# Altium schematic sheet Sheet1.SchDoc: *Omarichet Sat EPS
size Tabloid; CompanyName: *Omarichet_Space; DrawnBy: *Meshack_Kinyua; Engineer: *Meshack_Kinyua; Organization: *Omarichet Space; SheetNumber: 1; SheetTotal: 3
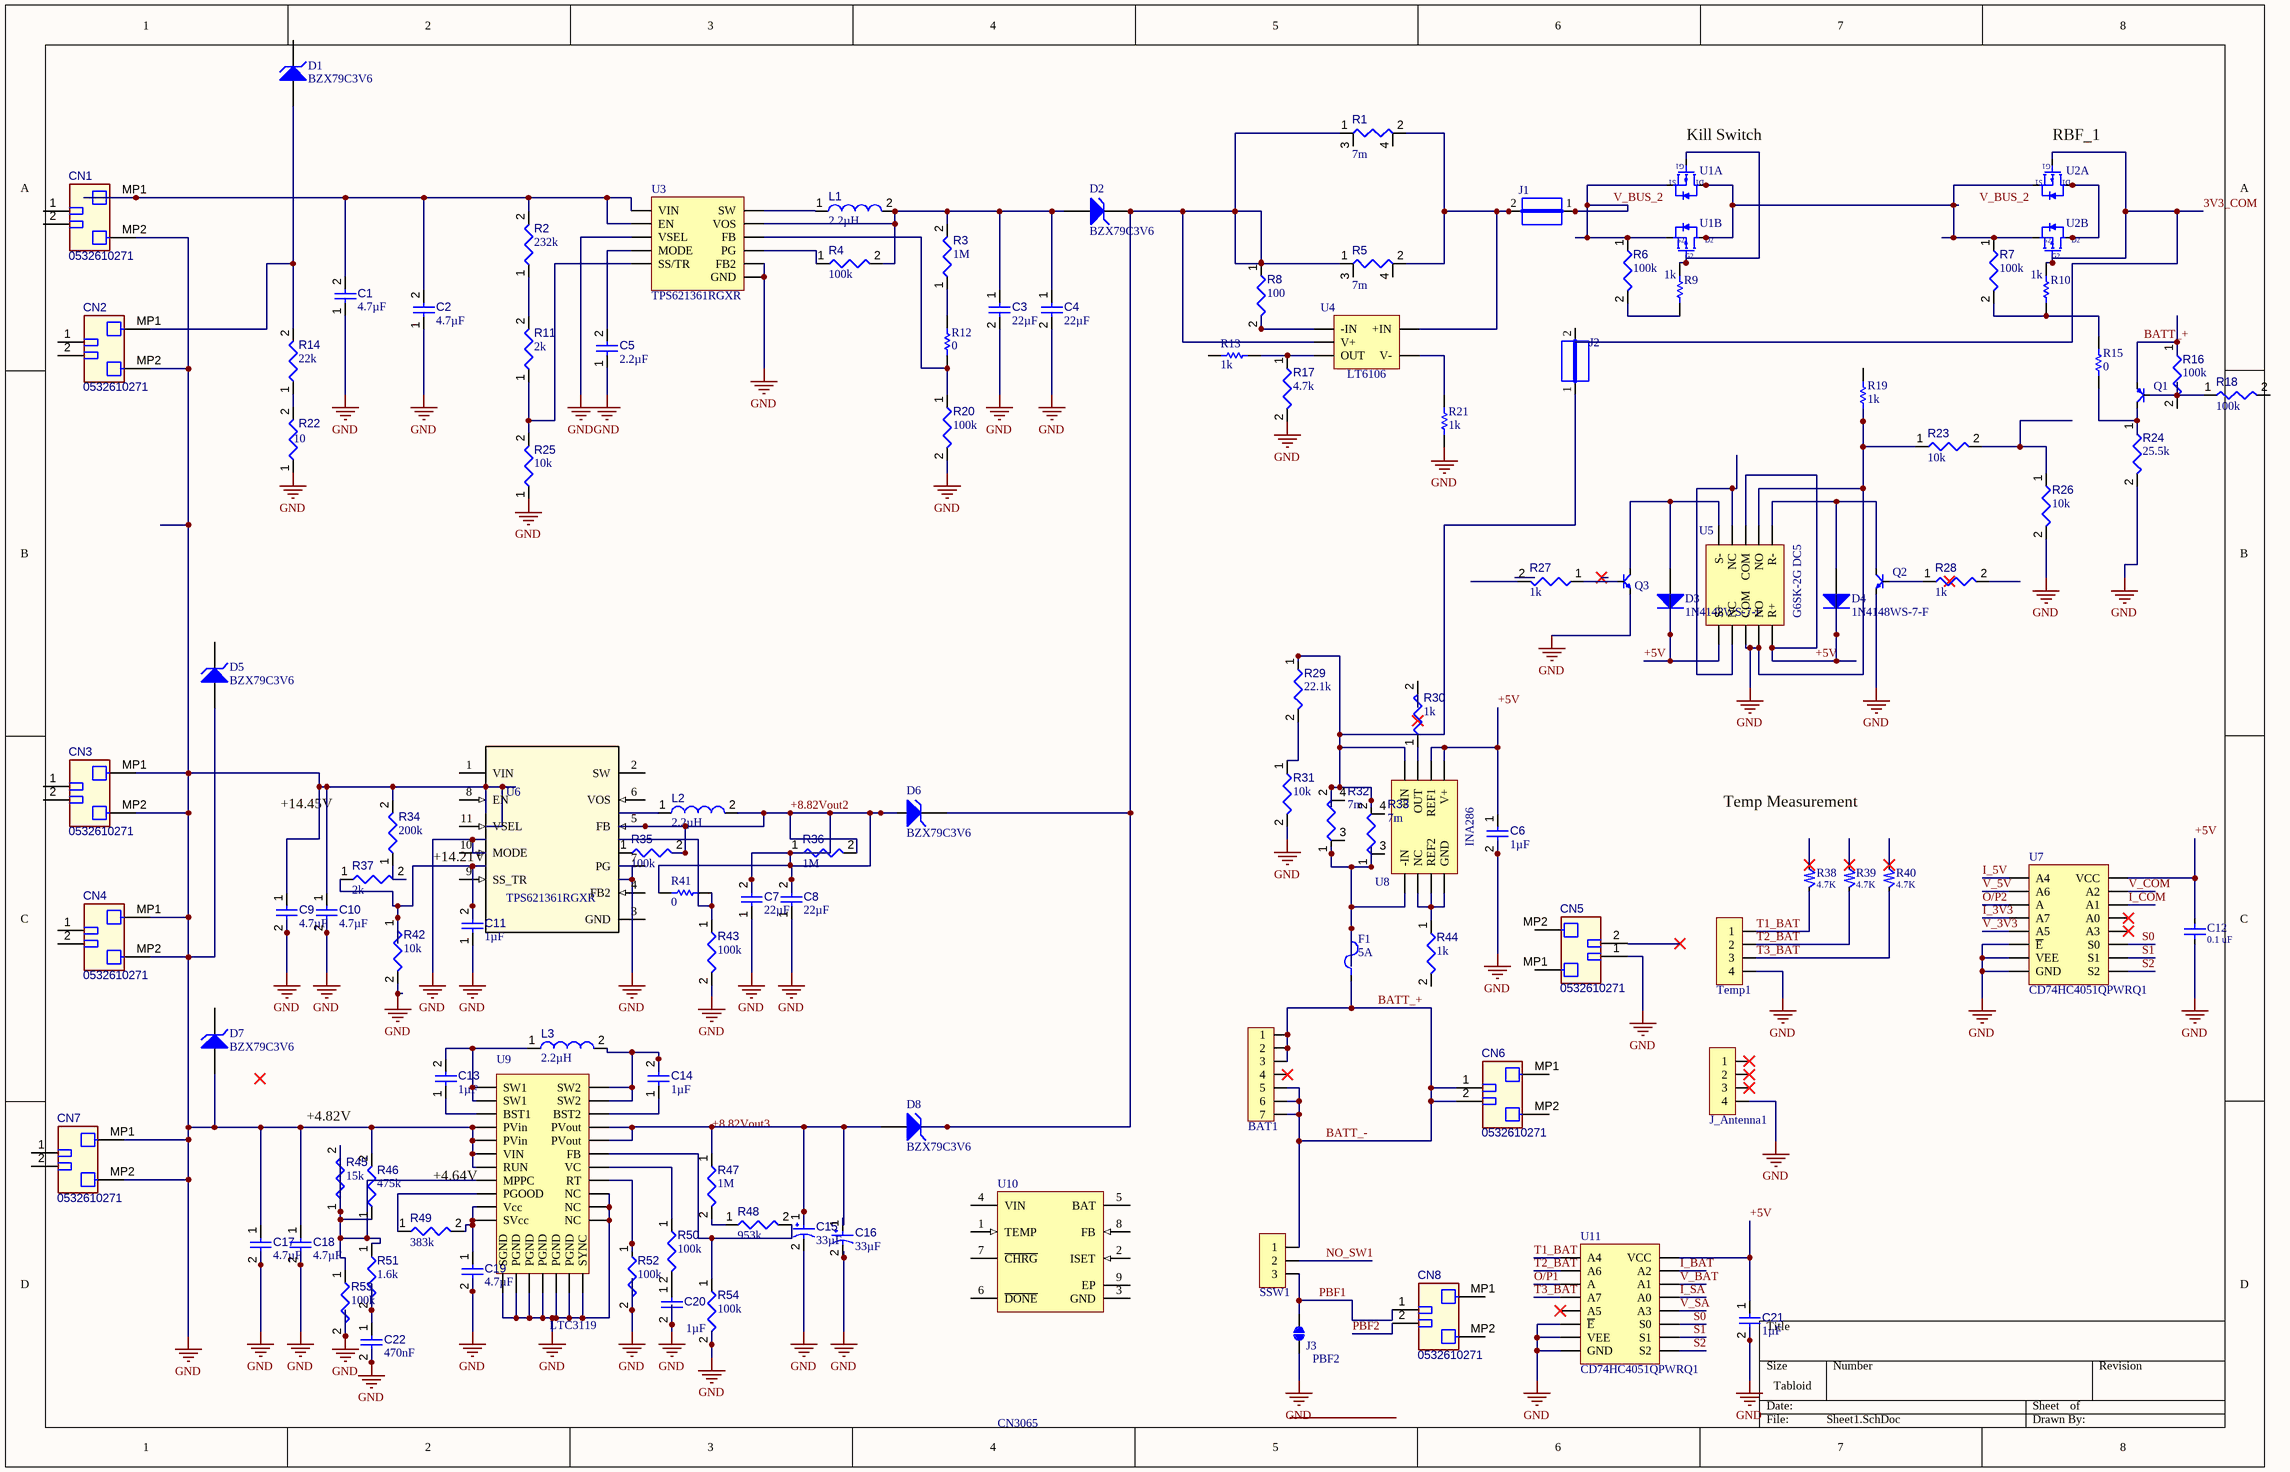
[diagram p0: Sheet1.SchDoc]

## Parts
BAT1  53261-0771  [Molex_0_MFG]  (value not drawn)
C1  value 4.7µF  [CAPC0603(1608)100_L]  (hidden comment: Capacitor 4.7µF +/-20% 10V 0603)
C2  value 4.7µF  [CAPC0603(1608)100_L]  (hidden comment: Capacitor 4.7µF +/-20% 10V 0603)
C3  value 22µF  [CAPC0805(2012)145_L]  (hidden comment: Capacitor 22µF +/-40% 16V 0805)
C4  value 22µF  [CAPC0805(2012)145_L]  (hidden comment: Capacitor 22µF +/-40% 16V 0805)
C5  value 2.2µF  [CAPC0402(1005)60_L]  (hidden comment: Capacitor 2,2µF +/-20% 10V 0402)
C6  value 1µF  [CAPC1608X90X40LL10T20]  (hidden comment: Capacitor 1 uF +/- 10% 25 V 0603)
C7  value 22µF  [CAPC0805(2012)145_L]  (hidden comment: Capacitor 22µF +/-40% 16V 0805)
C8  value 22µF  [CAPC0805(2012)145_L]  (hidden comment: Capacitor 22µF +/-40% 16V 0805)
C9  value 4.7µF  [CAPC0603(1608)100_L]  (hidden comment: Capacitor 4.7µF +/-20% 10V 0603)
C10  value 4.7µF  [CAPC0603(1608)100_L]  (hidden comment: Capacitor 4.7µF +/-20% 10V 0603)
C11  value 1µF  [CAPC1608X94X35NL15T15]  (hidden comment: Capacitor 1 uF +/- 10% 16 V 0603)
C12  value 0.1 uF  [C0805C104J4RACTU]  (hidden comment: C0805C104J4RACTU)
C13  value 1µF  [CAPC1608X94X35NL15T15]  (hidden comment: Capacitor 1 uF +/- 10% 16 V 0603)
C14  value 1µF  [CAPC1608X94X35NL15T15]  (hidden comment: Capacitor 1 uF +/- 10% 16 V 0603)
C15  value 33µF  [EEF-CX1E330R-Footprint-1]  (hidden comment: Capacitor 33µF +/-20% 25V 2917)
C16  value 33µF  [EEF-CX1E330R-Footprint-1]  (hidden comment: Capacitor 33µF +/-20% 25V 2917)
C17  value 4.7µF  [CAPC0603(1608)100_L]  (hidden comment: Capacitor 4.7µF +/-20% 10V 0603)
C18  value 4.7µF  [CAPC0603(1608)100_L]  (hidden comment: Capacitor 4.7µF +/-20% 10V 0603)
C19  value 4.7µF  [CAPC0603(1608)100_L]  (hidden comment: Capacitor 4.7µF +/-20% 10V 0603)
C20  value 1µF  [CAPC1005X55X25LL05T10]  (hidden comment: Capacitor 1 uF +/- 10% 6.3 V 0402)
C21  value 1µF  [CAPC1608X94X35NL15T15]  (hidden comment: Capacitor 1 uF +/- 10% 16 V 0603)
C22  value 470nF  [CAPC0402(1005)60_L]  (hidden comment: Capacitor 470nF +/-40% 10V 0402)
CN1  0532610271  [MOLX-532610271_V]
CN2  0532610271  [MOLX-532610271_V]
CN3  0532610271  [MOLX-532610271_V]
CN4  0532610271  [MOLX-532610271_V]
CN5  0532610271  [MOLX-532610271_V]
CN6  0532610271  [MOLX-532610271_V]
CN7  0532610271  [MOLX-532610271_V]
CN8  0532610271  [MOLX-532610271_V]
D1  BZX79C3V6  [FAIR-DO-35-2]
D2  BZX79C3V6  [FAIR-DO-35-2]
D3  1N4148WS-7-F  [DIOD-SOD323-2-A_V]
D4  1N4148WS-7-F  [DIOD-SOD323-2-A_V]
D5  BZX79C3V6  [FAIR-DO-35-2]
D6  BZX79C3V6  [FAIR-DO-35-2]
D7  BZX79C3V6  [FAIR-DO-35-2]
D8  BZX79C3V6  [FAIR-DO-35-2]
F1  Trip Current: 5A  [1206L500/12SLPR]  (hidden comment: 1206L500/12SLPR)
J1  JUMPER  [JUMPER]  (value not drawn)
J2  JUMPER  [JUMPER]  (value not drawn)
J3  JUMPER  [JUMPER]  (value not drawn)
J_Antenna1  53261-0471  [53261-0471]  (value not drawn)
L1  value 2.2µH  [IND1005X55X20VL5T10]  (hidden comment: ELJ-RF2N2DFB)
L2  value 2.2µH  [IND1005X55X20VL5T10]  (hidden comment: ELJ-RF2N2DFB)
L3  value 2.2µH  [IND1005X55X20VL5T10]  (hidden comment: ELJ-RF2N2DFB)
Q1  CMPT404A TR  [CMPT404A TR]  (value not drawn)
Q2  SMMBT3904LT3G  [SMMBT3904LT3G]  (value not drawn)
Q3  SMMBT3904LT3G  [SMMBT3904LT3G]  (value not drawn)
R1  value 7m  [SUSUMU-3216T4A]  (hidden comment: Resistor 7mR +/-1% 1206 63 mW)
R2  value 232k  [RESC0402(1005)_L]  (hidden comment: Resistor 232K +/-1 % 0402 63 mW)
R3  value 1M  [RESC0402(1005)_L]  (hidden comment: Resistor 1M +/-5 % 0402 63 mW)
R4  value 100k  [RESC3216X60X45ML15T20]  (hidden comment: Resistor 100k +/-1% 1206 250 mW)
R5  value 7m  [SUSUMU-3216T4A]  (hidden comment: Resistor 7mR +/-1% 1206 63 mW)
R6  value 100k  [RESC1608X55X25ML10T15]  (hidden comment: Resistor 100k +/-1% 0603 100 mW)
R7  value 100k  [RESC1608X55X25ML10T15]  (hidden comment: Resistor 100k +/-1% 0603 100 mW)
R8  value 100  [RESA60-630X240]  (hidden comment: MFR-25FBF52-100R)
R9  value 1k  [RESC3116X70X50ML13T20]  (hidden comment: Resistor 1k +/-1% 1206 250 mW)
R10  value 1k  [RESC3116X70X50ML13T20]  (hidden comment: Resistor 1k +/-1% 1206 250 mW)
R11  value 2k  [RESC0402(1005)_L]  (hidden comment: Resistor 2K +/-5 % 0402 63 mW)
R12  value 0  [RESC1608X55X25ML10T15]  (hidden comment: Resistor 0R +/- 5% 0603 100 mW)
R13  value 1k  [RESC2013X70X40ML20T20]  (hidden comment: Resistor 1k +/-1% 0805 125 mW)
R14  value 22k  [RESC0402(1005)_L]  (hidden comment: Resistor 22K  +/-1 % 0402 63 mW)
R15  value 0  [RESC1608X55X25ML10T15]  (hidden comment: Resistor 0R +/- 5% 0603 100 mW)
R16  value 100k  [RESC0402(1005)_L]  (hidden comment: Resistor 100K +/-1 % 0402 63 mW)
R17  value 4.7k  [RESC3116X70X50ML13T20]  (hidden comment: Resistor 4k7 +/-1% 1206 250 mW)
R18  value 100k  [RESC1005X40X25ML05T05]  (hidden comment: Resistor 1k +/-1% 0402 63 mW)
R19  value 1k  [RESC1005X40X25ML05T05]  (hidden comment: Resistor 1k +/-1% 0402 100 mW)
R20  value 100k  [RESC1608X55X25ML10T15]  (hidden comment: Resistor 100k +/-1% 0603 100 mW)
R21  value 1k  [RESC2013X70X40ML20T20]  (hidden comment: Resistor 1k +/-1% 0805 125 mW)
R22  value 10  [RESC1005X40X25ML10T10]  (hidden comment: Resistor 10R +/-5% 0402 63 mW)
R23  value 10k  [RESA60-630X240]  (hidden comment: MFR-25FBF52-10K)
R24  value 25.5k  [RESC0402(1005)_L]  (hidden comment: Resistor 25K5 +/-1 % 0402 63 mW)
R25  value 10k  [RESC1608X55X25ML10T15]  (hidden comment: Resistor 10k +/-1% 0603 100 mW)
R26  value 10k  [RESA60-630X240]  (hidden comment: MFR-25FBF52-10K)
R27  value 1k  [RESC0805(2012)_L]  (hidden comment: Resistor 1K +/-5% 0805 125 mW)
R28  value 1k  [RESC0805(2012)_L]  (hidden comment: Resistor 1K +/-5% 0805 125 mW)
R29  value 22.1k  [RESA60-630X240]  (hidden comment: MFR-25FBF52-22K1)
R30  value 1k  [RESC0805(2012)_L]  (hidden comment: Resistor 1K +/-5% 0805 125 mW)
R31  value 10k  [RESC2013X50X35ML15T15]  (hidden comment: Resistor 10k +/-1% 0805 125 mW)
R32  value 7m  [SUSUMU-3216T4A]  (hidden comment: Resistor 7mR +/-1% 1206 63 mW)
R33  value 7m  [SUSUMU-3216T4A]  (hidden comment: Resistor 7mR +/-1% 1206 63 mW)
R34  value 200k  [RESC0402(1005)_L]  (hidden comment: Resistor 200K +/-1 % 0402 63 mW)
R35  value 100k  [RESC1608X55X25ML10T15]  (hidden comment: Resistor 100k +/-1% 0603 100 mW)
R36  value 1M  [RESC0402(1005)_L]  (hidden comment: Resistor 1M +/-1 % 0402 63 mW)
R37  value 2k  [RESC0402(1005)_L]  (hidden comment: Resistor 2K +/-5 % 0402 63 mW)
R38  value 4.7K  [ERJ-P06F4701V]  (hidden comment: ERJ-P06F4701V)
R39  value 4.7K  [ERJ-P06F4701V]  (hidden comment: ERJ-P06F4701V)
R40  value 4.7K  [ERJ-P06F4701V]  (hidden comment: ERJ-P06F4701V)
R41  value 0  [RESC3116X70X50ML13T20]  (hidden comment: Resistor 0R +/- 0.05% 1206 250 mW)
R42  value 10k  [RESC1608X55X25ML10T15]  (hidden comment: Resistor 10k +/-1% 0603 100 mW)
R43  value 100k  [RESC1608X55X25ML10T15]  (hidden comment: Resistor 100k +/-1% 0603 100 mW)
R44  value 1k  [RESC0805(2012)_L]  (hidden comment: Resistor 1K +/-5% 0805 125 mW)
R45  value 15k  [RESC1005X40X25ML10T10]  (hidden comment: Resistor 15k +/-1% 0402 63 mW)
R46  value 475k  [RESA60-630X240]  (hidden comment: MFR-25FBF52-475K)
R47  value 1M  [RESA60-630X240]  (hidden comment: MFR-25FBF52-1M)
R48  value 953k  [RESC0402(1005)_L]  (hidden comment: 953KR2F)
R49  value 383k  [RESC0402(1005)_L]  (hidden comment: Resistor 383K +/-1 % 0402 63 mW)
R50  value 100k  [RESC1005X40X25ML05T05]  (hidden comment: Resistor 100k +/-1% 0402 63 mW)
R51  value 1.6k  [RESC0402(1005)_L]  (hidden comment: 1D6KR2J)
R52  value 100k  [RESC1005X40X25ML05T05]  (hidden comment: Resistor 100k +/-1% 0402 63 mW)
R53  value 100k  [RESC0402(1005)_L]  (hidden comment: 100KR2F)
R54  value 100k  [RESC3216X60X45ML15T20]  (hidden comment: Resistor 100k +/-1% 1206 250 mW)
SSW1  53261-0371  [53261-0371]  (value not drawn)
Temp1  53261-0471  [53261-0471]  (value not drawn)
U1  IRF7329TRPBF  [Infineon_PG-DSO-8_MFG]  (value not drawn)  (parts A,B of 2)
U2  IRF7329TRPBF  [Infineon_PG-DSO-8_MFG]  (value not drawn)  (parts A,B of 2)
U3  TPS621361RGXR  [RGX0011A]
U4  LT6106  [LT6106HS5#TRPBF]
U5  G6SK-2G DC5  [Omron_0_MFG]
U6  TPS621361RGXR  [RGX0011A]
U7  CD74HC4051QPWRQ1  [PW16]
U8  INA286  [D8_TEX]
U9  LTC3119  [FE_24_ADI]
U10  CN3065  [CONS-DFN-8_M]
U11  CD74HC4051QPWRQ1  [PW16]

## Nets
GND: C1.1 C2.1 C3.2 C4.2 C5.1 C6.2 C7.1 C8.1 C9.1 C9.2 C10.1 C10.2 C11.1 C12.1 C15.2 C16.2 C17.1 C17.2 C18.1 C18.2 C19.2 C20.2 C21.2 C22.2 CN1.MP2 CN2.MP2 CN3.MP1 CN3.MP2 CN4.MP1 CN4.MP2 CN5.1 CN7.MP1 CN7.MP2 D5.1(A) D7.1(A) J3.1 J_Antenna1.4 Q2.2(E) Q3.2(E) R17.2 R19.1 R20.2 R21.1 R22.1 R23.1 R24.2 R25.1 R26.2 R31.2 R34.2 R42.2 R43.2 R46.2 R52.2 R53.2 R54.2 Temp1.4 U3.3(GND) U3.4(FB2) U3.11(VSEL) U5.3(COM) U5.4(NO) U5.7(NO) U7.6(~{E}) U7.7(VEE) U7.8(GND) U9.1(PGND) U9.6(PGND) U9.11(SGND) U9.15(RUN) U9.16(VIN) U9.17(PGND) U9.19(PVin) U9.20(PVin) U9.22(PGND) U9.24(NC) U9.25(SYNC) U9.26(NC) U9.27(NC) U9.29(PGND) U11.6(~{E}) U11.7(VEE) U11.8(GND)
3V3_COM: R10.2 U2.2(G1) U2.4(G2)
+5V: C6.1 C12.2 C21.1 D3.2(K) D4.2(K) U5.1(S+) U5.5(R+) U5.8(COM) U7.16(VCC) U8.6(V+) U8.7(REF1) U11.16(VCC)
+8.82Vout2: C7.2 C8.2 D6.1(A) L2.2 R35.2 R36.1 R36.2 R41.1 U6.5(FB)
+8.82Vout3: C15.1 C16.1 D8.1(A) R47.1 U9.3(PVout) U9.4(PVout)
BATT_+: BAT1.1 BAT1.2 BAT1.3 BAT1.5 BAT1.6 BAT1.7 CN6.1 CN6.2 F1.1 Q1.3(C) R16.1 SSW1.1  [also labelled BATT_-]
I_3V3: U7.4(A7)
I_5V: U7.1(A4)
I_BAT: U11.15(A2)
I_COM: U7.14(A1)
I_SA: U11.13(A0)
NO_SW1: SSW1.2
O/P1: U11.3(A)
O/P2: U7.3(A)
PBF1: CN8.1 J3.2 SSW1.3
PBF2: CN8.2
S0: U7.11(S0) U11.11(S0)
S1: U7.10(S1) U11.10(S1)
S2: U7.9(S2) U11.9(S2)
T1_BAT: R38.1 Temp1.1 U11.1(A4)
T2_BAT: R39.1 Temp1.2 U11.2(A6)
T3_BAT: R40.1 Temp1.3 U11.4(A7)
V_3V3: U7.5(A5)
V_5V: U7.2(A6)
V_BAT: U11.14(A1)
V_BUS_2: J1.1 R6.1 U1.1(S1) U1.3(S2)
V_COM: U7.15(A2)
V_SA: U11.12(A3)
NetC1_2: C1.2 C2.2 CN1.MP1 R2.2 U3.1(VIN) U3.8(EN)
NetC3_1: C3.1 C4.1 D2.1(A) L1.2 R3.2 R4.2 U3.6(VOS)
NetC5_2: C5.2 U3.10(MODE)
NetC11_2: C11.2 R37.1 R42.1
NetC13_1: C13.1 U9.23(BST1)
NetC13_2: C13.2 L3.1 U9.18(SW1) U9.21(SW1)
NetC14_1: C14.1 U9.28(BST2)
NetC14_2: C14.2 L3.2 U9.2(SW2) U9.5(SW2)
NetC19_1: C19.1 R49.2 U9.8(SVcc) U9.13(Vcc)
NetC20_1: C20.1 R50.2
NetC22_1: C22.1 R51.2
NetCN2_MP1: CN2.MP1 D1.1(A) R14.2
NetD2_2: D2.2(K) D6.2(K) D8.2(K) R1.1(I1) R5.1(I1) R8.1 U4.5(V+)
NetD3_1: D3.1(A) Q3.3(C) U5.10(S-)
NetD4_1: D4.1(A) Q2.3(C) U5.6(R-)
NetF1_2: F1.2 R32.1(I1) R33.1(I1) U8.1(-IN)
NetJ1_2: J1.2 R1.2(I2) R5.2(I2) U4.4(+IN)
NetJ2_1: J2.1 R29.1 R32.2(I2) R33.2(I2) U8.8(+IN)
NetL1_1: L1.1 U3.2(SW)
NetQ1_1: Q1.1(B) R18.1
NetQ1_2: Q1.2(E) R15.1 R24.1
NetQ2_1: Q2.1(B) R28.1
NetQ3_1: Q3.1(B) R27.1
NetR2_1: R2.1 R11.2
NetR3_1: R3.1 R12.2
NetR4_1: R4.1 U3.7(PG)
NetR6_2: R6.2 R9.1
NetR7_1: R7.1 U1.5(D2) U1.6(D2) U1.7(D1) U1.8(D1) U2.1(S1) U2.3(S2)
NetR7_2: R7.2 R10.1 R15.2
NetR8_2: R8.2 U4.3(-IN)
NetR9_2: R9.2 U1.2(G1) U1.4(G2)
NetR11_1: R11.1 R25.2 U3.9(SS/TR)
NetR12_1: R12.1 R20.1 U3.5(FB)
NetR13_2: R13.2 R17.1 U4.1(OUT)
NetR14_1: R14.1 R22.2
NetR21_2: R21.2 U4.2(V-)
NetR23_2: R23.2 R26.1
NetR29_2: R29.2 R31.1
NetR30_1: R30.1 U8.5(OUT)
NetR34_1: R34.1 R37.2
NetR41_2: R41.2 R43.1
NetR44_1: R44.1 U8.2(GND) U8.3(REF2) U8.4(NC)
NetR45_1: R45.1 R45.2 R46.1 R51.1 R53.1 U9.12(MPPC)
NetR47_2: R47.2 R48.1
NetR48_2: R48.2 R54.1 U9.9(FB)
NetR49_1: R49.1 U9.7(PGOOD)
NetR50_1: R50.1 U9.10(VC)
NetR52_1: R52.1 U9.14(RT)
NetU2_5: U2.5(D2) U2.6(D2) U2.7(D1) U2.8(D1)
NetU5_2: U5.2(NC) U5.9(NC)

Not connected (* = marked no-connect by the designer): BAT1 4*; CN1 1 2; CN2 1 2; CN3 1 2; CN4 1 2; CN5 2* MP1 MP2; CN6 MP1 MP2; CN7 1 2; CN8 MP1 MP2; D1 2(K); D5 2(K); D7 2(K); J2 2; J_Antenna1 1* 2* 3*; L2 1; R1 3(E1) 4(E2); R5 3(E1) 4(E2); R13 1; R16 2; R18 2; R19 2; R27 2; R28 2; R30 2; R32 3(E1) 4(E2); R33 3(E1) 4(E2); R35 1; R38 2*; R39 2*; R40 2*; R44 2; U6 1(VIN) 2(SW) 3(GND) 4(FB2) 6(VOS) 7(PG) 8(EN) 9(SS_TR) 10(MODE) 11(VSEL); U7 12(A3)* 13(A0)*; U10 1(TEMP) 2(ISET) 3(GND) 4(VIN) 5(BAT) 6(~{DONE}) 7(~{CHRG}) 8(FB) 9(EP); U11 5(A5)*

## Notes on the sheet
- (near U1) Kill Switch
- (near U2) RBF_1
- +14.45V
- Temp Measurement
- (near U6) +14.21V
- +4.82V
- (near U9) +4.64V
- (near J3) PBF2
- Labels drawn without touching a wire or pin: V_BUS_2

## Library data of the parts
BAT1 = 53261-0771: CONN HEADER SMD R/A 7POS 1.25MM; Manufacturer: Molex; Body Plating: Tin; Number of Contacts: 7; Contact Resistance: 20mR; Connector Type: Blade Pin; Current Rating: 1A; Voltage Rating: 125V; Insulation Resistance: 100MR; Supplier 1: Digi-Key; Supplier Part Number 1: WM7625CT-ND; Manufacturer Part Number: 53261-0771; Stock 1: 18897; Pricing 1: 1=0.79, 10=0.668, 100=0.5198 (USD); Mount: Surface Mount; Contact Plating: Tin; Contact Material: Bronze,Tin,Brass; Color: Natural; Housing Color: Natural; Housing Material: Nylon; Min Operating Temperature: -40°C; Max Operating Temperature: 85°C; Termination: Solder; Number of Rows: 1; Orientation: Right Angle; Packaging: Tape and Reel; Number of Positions: 7; Series: PicoBlade; Contact Type: Blade Pin; Contact Gender: Male; Voltage Rating (AC): 125V; Working Voltage: 125V; Length: 13.9mm; Pitch: 1.25mm; Lead Pitch: 1.25mm; Depth: 5.2mm; Radiation Hardening: No; Flammability Rating: UL94 V-0; RoHS Compliant: Yes; REACH SVHC: Unknown; ComponentLink1URL: http://www.molex.com/pdm_docs/sd/532610771_sd.pdf?src-supplier=Digi-Key; ComponentLink1Description: http://www.molex.com/pdm_docs/sd/532610771_sd.pdf?src-supplier=Digi-Key; ComponentLink2URL: https://www.molex.com/pdm_docs/sd/532610771_sd.pdf?src-supplier=Digi-Key; ComponentLink2Description: https://www.molex.com/pdm_docs/sd/532610771_sd.pdf?src-supplier=Digi-Key; ComponentLink3URL: http://uk.rs-online.com/webdocs/13c4/0900766b813c44c2.pdf?src-supplier=RSComponents; ComponentLink3Description: http://uk.rs-online.com/webdocs/13c4/0900766b813c44c2.pdf?src-supplier=RSComponents; ComponentLink4URL: http://www.farnell.com/datasheets/1867373.pdf?src-supplier=Element14; ComponentLink4Description: http://www.farnell.com/datasheets/1867373.pdf?src-supplier=Element14; ComponentLink5URL: http://www.jameco.com/Jameco/Products/ProdDS/1932571.pdf?src-supplier=Jameco; ComponentLink5Description: http://www.jameco.com/Jameco/Products/ProdDS/1932571.pdf?src-supplier=Jameco; ComponentLink6URL: http://www.farnell.com/cad/1768013.pdf?src-supplier=Farnell; ComponentLink6Description: http://www.farnell.com/cad/1768013.pdf?src-supplier=Farnell; ComponentLink7URL: http://www.molex.com/webdocs/datasheets/pdf/en-us/0532610771_PCB_HEADERS.pdf?src-supplier=Avnet; ComponentLink7Description: http://www.molex.com/webdocs/datasheets/pdf/en-us/0532610771_PCB_HEADERS.pdf?src-supplier=Avnet; ComponentLink8URL: http://www.farnell.com/datasheets/1801021.pdf?src-supplier=Element14; ComponentLink8Description: http://www.farnell.com/datasheets/1801021.pdf?src-supplier=Element14
C1 C2 C9 C10 C17-C19 = CMP-001-00076-4: Chip Capacitor, 4.7µF +/-20%, 10V, 0603, Thickness 1 mm; Tolerance: 10%; Mounting Technology: SMT; Case/Package: 0603; Pins: 2; Min Operating Temperature: -55°C; Max Operating Temperature: 85°C; Voltage Rating: 10V
C3 C4 C7 C8 = CMP-001-00081-4: Chip Capacitor, 22µF +/-40%, 16V, 0805, Thickness 1.45 mm; Tolerance: 5%; Voltage Rating: 16V; Mounting Technology: SMT; Pins: 2; Max Operating Temperature: 85°C; Case/Package: 0805; Min Operating Temperature: -55°C
C5 = CMP-001-00056-4: Chip Capacitor, 2,2µF +/-20%, 10V, 0402, Thickness 0.6 mm; Tolerance: 10%; Mounting Technology: SMT; Max Operating Temperature: 85°C; Case/Package: 0402; Pins: 2; Min Operating Temperature: -55°C; Voltage Rating: 10V
C6 = CMP-001-00005-6: Chip Capacitor, 1 uF, +/- 10%, 25 V, 0603 (1608 Metric); Capacitor Type: Ceramic; Voltage Rating: 25V; Pins: 2; Mounting Technology: SM; RoHS Compliant: True; Max Operating Temperature: 125°C; Case/Package: 0603; Min Operating Temperature: -55°C; Tolerance: 10%
C11 C13 C14 C21 = CMP-001-00003-6: Chip Capacitor, 1 uF, +/- 10%, 16 V, 0603 (1608 Metric); Voltage Rating: 16V; Capacitor Type: Ceramic; Max Operating Temperature: 125°C; Pins: 2; Tolerance: 10%; Min Operating Temperature: -55°C; RoHS Compliant: True; Mounting Technology: SM; Case/Package: 0603
C12 = C0805C104J4RACTU: CAP CER 0.1UF 16V X7R 0805; Manufacturer: KEMET; Tolerance: ±5%; Notification: Current market demand for these product types have resulted in fluctuating and extending lead times. Lead times may differ.; Supplier 1: Digi-Key; Manufacturer Part Number: C0805C104J4RACTU; RoHS: RoHS Compliant; Category: Capacitors; Stock 1: 1390; Pricing 1: 1=0.6, 10=0.424, 100=0.2795, 500=0.207, 1000=0.17595 (USD); Packaging: Cut Tape (CT); Part Status: Active; Voltage - Rated: 16V; Temperature Coefficient: X7R; Operating Temperature: -55°C ~ 125°C; Features: Low ESL; Ratings: -; Applications: General Purpose; Failure Rate: -; Mounting Type: Surface Mount, MLCC; Package / Case: 0805 (2012 Metric); Size / Dimension: 0.079" L x 0.049" W (2.00mm x 1.25mm); Height - Seated (Max): -; Thickness (Max): 0.035" (0.88mm); Lead Spacing: -; Lead Style: -; ComponentLink1URL: https://search.kemet.com/component-edge/download/datasheet/C0805C104J4RACTU.pdf; ComponentLink1Description: https://search.kemet.com/component-edge/download/datasheet/C0805C104J4RACTU.pdf; Supplier Part Number 1: 399-11163-1-ND
C15 C16 = CMP-001-00064-3: Aluminum Organic Polymer Capacitors 33uF 25volt SP-Cap AEC-Q200; Tolerance: 20%; Pins: 2; Max Operating Temperature: 105°C; Min Operating Temperature: -40°C; Case/Package: 2917; Mounting Technology: SMT; Voltage Rating: 25V
C20 = CMP-001-00008-6: Chip Capacitor, 1 uF, +/- 10%, 6.3 V, 0402 (1005 Metric); Capacitor Type: Ceramic; Voltage Rating: 6.3V; Max Operating Temperature: 85°C; Mounting Technology: SM; Tolerance: 10%; Case/Package: 0402; RoHS Compliant: True; Min Operating Temperature: -55°C; Pins: 2
C22 = CMP-001-00060-4: Chip Capacitor, 470nF +/-40%, 10V, 0402, Thickness 0.6 mm; Tolerance: 20%; Max Operating Temperature: 85°C; Case/Package: 0402; Voltage Rating: 10V; Min Operating Temperature: -55°C; Mounting Technology: SMT; Pins: 2
CN1-CN8 = CMP-002-00051-3: Header, Pitch 1.25 mm, 1 x 2 Position, Height 3.6 mm, -40 to 85 degC; Connector Type: WiretoBoard; Gender: HDR; Pins: 4
D1 D2 D5-D8 = CMP-004-00021-2: Zener Diode, 3.6 V, 5 mA, -65 to 200 degC, 2-Pin DO-35, RoHS, Bulk; Manufacturer: Fairchild Semiconductor; Tolerance: 6%; Power: 500mW; Forward Voltage: 1.5V; Impedance: 90Ohm; Package Quantity: 1000; Min Operating Temperature: -65°C; Datasheet Version: Rev. C1, 07/2007; Max Operating Temperature: 200°C; Mounting Technology: TH; Package Description: 2-Pin Through Hole Diode, Dia 1.72 mm, Body Length 3.805 mm; RoHS Compliant: True; Manufacturer URL: https://www.fairchildsemi.com/; Package Reference: DO-35-2; Case/Package: DO-35-2; Datasheet URL: https://www.fairchildsemi.com/datasheets/BZ/BZX79C3V6.pdf; Package URL: https://www.fairchildsemi.com/package-drawings/DO/DO35A.pdf; Pins: 2; Packaging: Bulk
D3 D4 = CMP-004-00002-2: Fast Switching Diode, 75 V, 0.3 A, -65 to 150 degC, 2-Pin SOD323, RoHS, Tape and Reel; Manufacturer: Diodes Inc; Peak Reverse Current: 1uA; Max Surge Current: 2A; Elements: 1; Forward Current: 300mA; Recovery Time: 4ns; Forward Voltage: 1.25V; Datasheet Version: Rev. 25-2, 03/2016; Case/Package: SOD; Min Operating Temperature: -65°C; RoHS Compliant: True; Max Operating Temperature: 150°C; Manufacturer URL: http://www.diodes.com/; Pins: 2; Package Quantity: 3000; Datasheet URL: http://www.diodes.com/datasheets/ds30097.pdf; Packaging: TapeandReel; Package Description: 2-Pin Small Outline Diode, Body 1.7 x 1.3 mm; Mounting Technology: SM; Package Reference: SOD323-2
F1 = 1206L500/12SLPR: PTC RESET FUSE 5.0A 12V 1206; Manufacturer: Littelfuse; Supplier 1: Mouser; Supplier Part Number 1: 576-1206L500/12SLPR; Manufacturer Part Number: 1206L500/12SLPR; Stock 1: 2000; Pricing 1: 1=1.95, 10=1.85, 25=1.49, 100=1.27, 250=1.23, 500=1.04 (USD)
J1 J2 = CMP-009-00061-2: Pins: 2
J3 = JUMPER: OPTION SELECTION 2POS PAD; Supplier 1: Digi-Key
J_Antenna1 Temp1 = 53261-0471: CONN HEADER SMD R/A 4POS 1.25MM; Manufacturer: Molex; Number of Positions: 4; Gender: Male; Contact Resistance: 20mR; Current Rating: 1A; Voltage Rating (AC): 125V; Insulation Resistance: 100MR; Glow Wire Compliant: Non-compliant; Supplier 1: Digi-Key; Supplier Part Number 1: WM7622CT-ND; Manufacturer Part Number: 53261-0471; Stock 1: 35326; Pricing 1: 1=0.59, 10=0.499, 100=0.3883 (USD); Mount: Surface Mount; Contact Plating: Tin; Contact Material: Tin; Color: Beige; Housing Material: Thermoplastic; Housing Color: Natural; Weight: 0.005598oz; Min Operating Temperature: -40°C; Max Operating Temperature: 105°C; Termination: SMD/SMT; Number of Rows: 1; Packaging: Cut Tape; Number of Contacts: 4; Orientation: Right Angle; Series: 53261; Package Quantity: 1000; Contact Type: -; Number of Circuits: 4; Voltage Rating: 125V; Working Voltage: 125V; Voltage Rating (DC): 125V; Contact Gender: Male; Pitch: 1.25mm; Lead Pitch: 1.25mm; Radiation Hardening: No; RoHS Compliant: Yes; Lead Free: Lead Free; Flammability Rating: UL94 V-0; REACH SVHC: Unknown; ComponentLink1URL: http://www.mouser.com/ds/2/276/0532610471_PCB_HEADERS-170942.pdf?src-supplier=Mouser; ComponentLink1Description: http://www.mouser.com/ds/2/276/0532610471_PCB_HEADERS-170942.pdf?src-supplier=Mouser; ComponentLink2URL: http://components.arrow.com/part/dataview/41622439S9851324N3303?src-supplier=Arrow+Electronics; ComponentLink2Description: http://components.arrow.com/part/dataview/41622439S9851324N3303?src-supplier=Arrow+Electronics; ComponentLink3URL: http://uk.rs-online.com/webdocs/1380/0900766b8138010d.pdf?src-supplier=RSComponents; ComponentLink3Description: http://uk.rs-online.com/webdocs/1380/0900766b8138010d.pdf?src-supplier=RSComponents; ComponentLink4URL: http://www.farnell.com/datasheets/1867384.pdf?src-supplier=Element14; ComponentLink4Description: http://www.farnell.com/datasheets/1867384.pdf?src-supplier=Element14; ComponentLink5URL: http://www.molex.com/webdocs/datasheets/pdf/en-us/0532610471_PCB_HEADERS.pdf?src-supplier=Avnet+Europe; ComponentLink5Description: http://www.molex.com/webdocs/datasheets/pdf/en-us/0532610471_PCB_HEADERS.pdf?src-supplier=Avnet+Europe; ComponentLink6URL: http://www.molex.com/webdocs/datasheets/pdf/en-us/0532610471_PCB_HEADERS.pdf?src-supplier=Avnet; ComponentLink6Description: http://www.molex.com/webdocs/datasheets/pdf/en-us/0532610471_PCB_HEADERS.pdf?src-supplier=Avnet; ComponentLink7URL: http://www.farnell.com/datasheets/2697767.pdf?src-supplier=Newark; ComponentLink7Description: http://www.farnell.com/datasheets/2697767.pdf?src-supplier=Newark; ComponentLink8URL: https://www.alliedelec.com/m/d/74d14d19c60ab078e4881c4c1bd42ef7.pdf?src-supplier=Allied+Electronics; ComponentLink8Description: https://www.alliedelec.com/m/d/74d14d19c60ab078e4881c4c1bd42ef7.pdf?src-supplier=Allied+Electronics; ComponentLink9URL: http://www.jameco.com/Jameco/Products/ProdDS/1932555.pdf?src-supplier=Jameco; ComponentLink9Description: http://www.jameco.com/Jameco/Products/ProdDS/1932555.pdf?src-supplier=Jameco
L1-L3 = CMP-006-00006-6: Chip Inductor, 2.2 nH, +/- 0.3 nH, 400 mA, -40 to 85 degC, 0402 (1005 Metric), RoHS, Tape and Reel; Manufacturer: Panasonic; Shielding: Unshielded; Current Rating: 400mA; Tolerance: 5%; Core Material: Ceramic; Q Factor: 8; Datasheet URL: http://www.bourns.com/docs/Product-Datasheets/cm322522.pdf; Case/Package: 0402; RoHS Compliant: True; Package Description: 2-Pin Surface Mount Device, Body 1 x 0.5 mm; Packaging: TapeandReel; Datasheet Version: Sep-12; Package Quantity: 10000; Package Reference: 0402; Min Operating Temperature: -20°C; Mounting Technology: SM; Max Operating Temperature: 85°C
Q1 = CMPT404A TR: Bipolar Transistors - BJT PNP Silicon Chopper SMT Transistor; Manufacturer: Central Semiconductor; hFE Min: 100; Max Power Dissipation: 350mW; Collector Base Voltage (VCBO): 40V; Collector Emitter Voltage (VCEO): 35V; Emitter Base Voltage (VEBO): 25V; Collector Emitter Saturation Voltage: 200mV; Continuous Collector Current: 150mA; Element Configuration: Single; Supplier 1: Mouser; Supplier Part Number 1: 610-CMPT404A-TR; Manufacturer Part Number: CMPT404A TR; Stock 1: 0; Case/Package: SOT-23; Min Operating Temperature: -65°C; Max Operating Temperature: 150°C; Packaging: Tape and Reel; Package Quantity: 3000; Polarity: PNP; Lead Free: Lead Free; ComponentLink1URL: http://www.mouser.com/ds/2/68/cmpt404a_r1-258738.pdf?src-supplier=Mouser; ComponentLink1Description: http://www.mouser.com/ds/2/68/cmpt404a_r1-258738.pdf?src-supplier=Mouser; ComponentLink2URL: http://www.centralsemi.com/PDFs/products/CMPT404A_R1.PDF?src-supplier=Future+Electronics; ComponentLink2Description: http://www.centralsemi.com/PDFs/products/CMPT404A_R1.PDF?src-supplier=Future+Electronics; ComponentLink3URL: http://datasheet.octopart.com/CMPT404A-TR-Central-Semiconductor-datasheet-527503.pdf?src-supplier=Future+Electronics; ComponentLink3Description: http://datasheet.octopart.com/CMPT404A-TR-Central-Semiconductor-datasheet-527503.pdf?src-supplier=Future+Electronics; ComponentLink4URL: http://datasheet.octopart.com/CMPT404A-TR-Central-Semiconductor-datasheet-13529226.pdf?src-supplier=Future+Electronics; ComponentLink4Description: http://datasheet.octopart.com/CMPT404A-TR-Central-Semiconductor-datasheet-13529226.pdf?src-supplier=Future+Electronics; ComponentLink5Description: New link; ComponentLink5URL: *; ComponentLink6Description: New link; ComponentLink6URL: *
Q2 Q3 = SMMBT3904LT3G: TRANS NPN 40V 0.2A SOT23; Manufacturer: ON Semiconductor; Vce Saturation (Max) @ Ib, Ic: 300mV @ 5mA, 50mA; DC Current Gain (hFE) (Min) @ Ic, Vce: 100 @ 10mA, 1V; Frequency - Transition: 300MHz; Supplier 1: Digi-Key; Manufacturer Part Number: SMMBT3904LT3G; RoHS: RoHS Compliant; Category: Discrete Semiconductor Products; Stock 1: 4146; Pricing 1: 1=0.31, 10=0.256, 100=0.1356, 500=0.08922, 1000=0.06067 (USD); Packaging: Cut Tape (CT); Part Status: Active; Transistor Type: NPN; Current - Collector Cutoff (Max): -; Operating Temperature: -55°C ~ 150°C (TJ); Mounting Type: Surface Mount; Package / Case: TO-236-3, SC-59, SOT-23-3; Supplier Device Package: SOT-23-3 (TO-236); ComponentLink1URL: http://www.onsemi.com/pub/Collateral/MMBT3904LT1-D.PDF; ComponentLink1Description: http://www.onsemi.com/pub/Collateral/MMBT3904LT1-D.PDF; Supplier Part Number 1: SMMBT3904LT3GOSCT-ND
R1 R5 R32 R33 = CMP-009-00119-3: Chip Resistor, 0,007 Ohms, +/-1%, 63 mW, -55 to 155 degC, 1206; Tolerance: 1%; Max Operating Temperature: 155°C; Min Operating Temperature: -55°C; Pins: 4; Case/Package: 1206
R2 = CMP-009-00127-3: Chip Resistor, 232 kOhms, +/-1 %, 63 mW, -55 to 155 degC, 0402; Power: 63mW; Tolerance: 1%; Case/Package: 0402; Pins: 2
R3 = CMP-009-00151-3: Chip Resistor, 1 MOhms, +/-5 %, 63 mW, -55 to 155 degC, 0402; Power: 63mW; Tolerance: 5%; Pins: 2; Min Operating Temperature: -55°C; Case/Package: 0402; Max Operating Temperature: 155°C
R4 R54 = CMP-009-00025-5: Chip Resistor, 100 KOhm, +/- 1%, 0.25 W, -55 to 155 degC, 1206 (3216 Metric); Voltage Rating: 200V; Power: 250mW; RoHS Compliant: True; Max Operating Temperature: 155°C; Pins: 2; Tolerance: 1%; Mounting Technology: SM; Case/Package: 1206; Min Operating Temperature: -55°C
R6 R7 R20 R35 R43 = CMP-009-00023-5: Chip Resistor, 100 KOhm, +/- 1%, 0.1 W, -55 to 155 degC, 0603 (1608 Metric); Voltage Rating: 50V; Power: 100mW; Max Operating Temperature: 155°C; RoHS Compliant: True; Tolerance: 1%; Pins: 2; Case/Package: 0603; Mounting Technology: SM; Min Operating Temperature: -55°C
R8 = CMP-009-00046-4: Axial Resistor, 100 Ohm, +/- 1%, 0.25 W, -55 to 155 degC, 2-Pin THD, RoHS, Bulk; Manufacturer: Yageo; Voltage Rating: 250V; Power: 250mW; Packaging: Bulk; Max Operating Temperature: 155°C; Mounting Technology: TH; Datasheet Version: Apr-13; Case/Package: Axial; RoHS Compliant: True; Package Description: 2-Pin Axial Lead, Dia 2.4 mm, Body Length 6.3 mm; Package Quantity: 200; Package Reference: MFR-25; Tolerance: 1%; Composition: CarbonFilm; Datasheet URL: http://www.yageo.com/documents/recent/Yageo%20LR_MFR_2013.pdf; Manufacturer URL: http://www.yageo.com/; Min Operating Temperature: -55°C
R9 R10 = CMP-009-00011-5: Chip Resistor, 1 KOhm, +/- 1%, 0.25 W, -55 to 155 degC, 1206 (3216 Metric); Voltage Rating: 200V; Power: 250mW; Max Operating Temperature: 155°C; Mounting Technology: SM; Tolerance: 1%; Case/Package: 1206; RoHS Compliant: True; Min Operating Temperature: -55°C; Pins: 2
R11 R37 = CMP-009-00138-3: Chip Resistor, 2 kOhms, +/-5 %, 63 mW, -55 to 155 degC, 0402; Tolerance: 5%; Power: 63mW; Max Operating Temperature: 155°C; Pins: 2; Min Operating Temperature: -55°C; Case/Package: 0402
R12 R15 = CMP-009-00006-5: Chip Resistor, 0 Ohm, 0.1 W, -55 to 155 degC, 0603 (1608 Metric); Power: 100mW; Voltage Rating: 50V; Max Operating Temperature: 155°C; RoHS Compliant: True; Mounting Technology: SM; Case/Package: 0603; Min Operating Temperature: -55°C; Tolerance: 5%; Pins: 2
R13 R21 = CMP-009-00010-5: Chip Resistor, 1 KOhm, +/- 1%, 0.125 W, -55 to 155 degC, 0805 (2013 Metric); Power: 125mW; Voltage Rating: 150V; Tolerance: 1%; RoHS Compliant: True; Mounting Technology: SM; Pins: 2; Case/Package: 0805; Max Operating Temperature: 155°C; Min Operating Temperature: -55°C
R14 = CMP-009-00123-3: Chip Resistor, 22 kOhms, +/-1 %, 63 mW, -55 to 155 degC, 0402; Power: 63mW; Tolerance: 1%; Pins: 2; Min Operating Temperature: -55°C; Max Operating Temperature: 155°C; Case/Package: 0402
R16 = CMP-009-00168-3: Chip Resistor, 100 kOhms, +/-1 %, 63 mW, -55 to 155 degC, 0402; Tolerance: 1%; Power: 63mW; Max Operating Temperature: 155°C; Min Operating Temperature: -55°C; Pins: 2; Case/Package: 0402
R17 = CMP-009-00033-5: Chip Resistor, 4.7 KOhm, +/- 1%, 0.25 W, -55 to 155 degC, 1206 (3216 Metric); Power: 250mW; Voltage Rating: 200V; Pins: 2; Min Operating Temperature: -55°C; Max Operating Temperature: 155°C; Case/Package: 1206; Tolerance: 1%; RoHS Compliant: True; Mounting Technology: SM
R18 = CMP-009-00012-5: Chip Resistor, 1 KOhm, +/- 1%, 63 mW, -55 to 155 degC, 0402 (1005 Metric); Power: 63mW; Max Operating Temperature: 155°C; Min Operating Temperature: -55°C; Case/Package: 0402; Pins: 2; RoHS Compliant: True; Tolerance: 1%; Mounting Technology: SM
R19 = CMP-009-00009-5: Chip Resistor, 1 KOhm, +/- 1%, 0.1 W, -55 to 155 degC, 0402 (1005 Metric); Power: 100mW; Voltage Rating: 50V; Min Operating Temperature: -55°C; Max Operating Temperature: 155°C; RoHS Compliant: True; Mounting Technology: SM; Pins: 2; Tolerance: 1%; Case/Package: 0402
R22 = CMP-009-00020-5: Chip Resistor, 10 Ohm, +/- 5%, 0.063 W, -55 to 155 degC, 0402 (1005 Metric); Power: 63mW; Case/Package: 0402; Max Operating Temperature: 155°C; Min Operating Temperature: -55°C; Pins: 2; Tolerance: 5%; RoHS Compliant: True; Mounting Technology: SM
R23 R26 = CMP-009-00047-4: Axial Resistor, 10 KOhm, +/- 1%, 0.25 W, -55 to 155 degC, 2-Pin THD, RoHS, Bulk; Manufacturer: Yageo; Power: 250mW; Voltage Rating: 250V; Manufacturer URL: http://www.yageo.com/; Datasheet URL: http://www.yageo.com/documents/recent/Yageo%20LR_MFR_2013.pdf; Package Reference: MFR-25; Min Operating Temperature: -55°C; Mounting Technology: TH; Package Quantity: 200; Case/Package: Axial; Tolerance: 1%; RoHS Compliant: True; Datasheet Version: Apr-13; Packaging: Bulk; Max Operating Temperature: 155°C; Package Description: 2-Pin Axial Lead, Dia 2.4 mm, Body Length 6.3 mm
R24 = CMP-009-00171-3: Chip Resistor, 25,5 kOhms, +/-1 %, 63 mW, -55 to 155 degC, 0402; Tolerance: 1%; Power: 63mW; Case/Package: 0402; Min Operating Temperature: -55°C; Max Operating Temperature: 155°C; Pins: 2
R25 R42 = CMP-009-00017-5: Chip Resistor, 10 KOhm, +/- 1%, 01 W, -55 to 155 degC, 0603 (1608 Metric); Voltage Rating: 50V; Power: 100mW; RoHS Compliant: True; Min Operating Temperature: -55°C; Pins: 2; Case/Package: 0603; Mounting Technology: SM; Max Operating Temperature: 155°C; Tolerance: 1%
R27 R28 R30 R44 = CMP-009-00118-3: Chip Resistor, 1 kOhms, +/-5%, 125 mW, -55 to 155 degC, 0805; Tolerance: 5%; Power: 125mW; Case/Package: 0805; Pins: 2; Min Operating Temperature: -55°C; Max Operating Temperature: 155°C
R29 = CMP-009-00052-4: Axial Resistor, 22.1 KOhm, +/- 1%, 0.25 W, -55 to 155 degC, 2-Pin THD, RoHS, Bulk; Manufacturer: Yageo; Power: 250mW; Voltage Rating: 250V; Packaging: Bulk; Max Operating Temperature: 155°C; Case/Package: Axial; Tolerance: 1%; Mounting Technology: TH; Min Operating Temperature: -55°C; RoHS Compliant: True; Package Quantity: 200; Package Reference: MFR-25; Manufacturer URL: http://www.yageo.com/; Package Description: 2-Pin Axial Lead, Dia 2.4 mm, Body Length 6.3 mm; Datasheet Version: Apr-13; Datasheet URL: http://www.yageo.com/documents/recent/Yageo%20LR_MFR_2013.pdf
R31 = CMP-009-00018-5: Chip Resistor, 10 KOhm, +/- 1%, 125 mW, -55 to 155 degC, 0805 (2012 Metric); Power: 125mW; Voltage Rating: 150V; Tolerance: 1%; Pins: 2; Min Operating Temperature: -55°C; Case/Package: 0805; Max Operating Temperature: 155°C; RoHS Compliant: True; Mounting Technology: SM
R34 = CMP-009-00163-3: Chip Resistor, 200 kOhms, +/-1 %, 63 mW, -55 to 155 degC, 0402; Power: 63mW; Tolerance: 1%; Min Operating Temperature: -55°C; Max Operating Temperature: 155°C; Case/Package: 0402; Pins: 2
R36 = CMP-009-00165-3: Chip Resistor, 1 MOhms, +/-1 %, 63 mW, -55 to 155 degC, 0402; Tolerance: 1%; Power: 63mW; Case/Package: 0402; Pins: 2
R38-R40 = ERJ-P06F4701V: RES 4.7K OHM 1% 1/2W 0805; Manufacturer: Panasonic Electronic Components; Power (Watts): 0.5W, 1/2W; Temperature Coefficient: ±100ppm/°C; Supplier 1: Digi-Key; Manufacturer Part Number: ERJ-P06F4701V; RoHS: RoHS Compliant; Category: Resistors; Stock 1: 38687; Pricing 1: 1=0.19, 10=0.159, 100=0.0622, 1000=0.02604, 2500=0.02386 (USD); Packaging: Cut Tape (CT); Part Status: Active; Tolerance: ±1%; Composition: Thick Film; Features: Automotive AEC-Q200, Pulse Withstanding; Operating Temperature: -55°C ~ 155°C; Package / Case: 0805 (2012 Metric); Supplier Device Package: 0805; Size / Dimension: 0.079" L x 0.049" W (2.00mm x 1.25mm); Height - Seated (Max): 0.028" (0.70mm); Failure Rate: -; ComponentLink1URL: https://industrial.panasonic.com/cdbs/www-data/pdf/RDO0000/AOA0000C331.pdf; ComponentLink1Description: https://industrial.panasonic.com/cdbs/www-data/pdf/RDO0000/AOA0000C331.pdf; Supplier Part Number 1: P16073CT-ND
R41 = CMP-009-00008-5: Chip Resistor, 0 Ohm, 0.25 W, -55 to 155 degC, 1206 (3216 Metric); Voltage Rating: 200V; Power: 250mW; Pins: 2; Min Operating Temperature: -55°C; Tolerance: 0.05%; RoHS Compliant: True; Max Operating Temperature: 155°C; Mounting Technology: SM; Case/Package: 1206
R45 = CMP-009-00026-5: Chip Resistor, 15 KOhm, +/- 1%, 0.063 W, -55 to 155 degC, 0402 (1005 Metric); Power: 63mW; Min Operating Temperature: -55°C; Tolerance: 1%; Max Operating Temperature: 155°C; Mounting Technology: SM; Case/Package: 0402; RoHS Compliant: True; Pins: 2
R46 = CMP-009-00055-4: Axial Resistor, 475 KOhm, +/- 1%, 0.25 W, -55 to 155 degC, 2-Pin THD, RoHS, Bulk; Manufacturer: Yageo; Power: 250mW; Voltage Rating: 250V; Case/Package: Axial; Mounting Technology: TH; RoHS Compliant: True; Package Description: 2-Pin Axial Lead, Dia 2.4 mm, Body Length 6.3 mm; Min Operating Temperature: -55°C; Datasheet URL: http://www.yageo.com/documents/recent/Yageo%20LR_MFR_2013.pdf; Manufacturer URL: http://www.yageo.com/; Package Quantity: 200; Package Reference: MFR-25; Max Operating Temperature: 155°C; Datasheet Version: Apr-13; Tolerance: 1%; Packaging: Bulk
R47 = CMP-009-00049-4: Axial Resistor, 1 MOhm, +/- 1%, 250 mW, -55 to 155 degC, 2-Pin THD, RoHS, Bulk; Manufacturer: Yageo; Voltage Rating: 250V; Power: 250mW; Datasheet Version: Apr-13; Package Reference: MFR-25; Package Quantity: 200; Min Operating Temperature: -55°C; RoHS Compliant: True; Mounting Technology: TH; Datasheet URL: http://www.yageo.com/documents/recent/Yageo%20LR_MFR_2013.pdf; Max Operating Temperature: 155°C; Package Description: 2-Pin Axial Lead, Dia 2.4 mm, Body Length 6.3 mm; Packaging: Bulk; Tolerance: 1%; Case/Package: Axial; Manufacturer URL: http://www.yageo.com/
R48 = CMP-009-00113-3: 953K 0.063W 1% 0402 (1005 Metric)  SMD; Power: 63mW; Mounting Technology: SMT; Case/Package: 0402; Tolerance: 1%; Pins: 2
R49 = CMP-009-00126-3: Chip Resistor, 383 kOhms, +/-1 %, 63 mW, -55 to 155 degC, 0402; Tolerance: 1%; Power: 63mW; Max Operating Temperature: 155°C; Pins: 2; Min Operating Temperature: -55°C; Case/Package: 0402
R50 R52 = CMP-009-00021-5: Chip Resistor, 100 KOhm, +/- 1%, 0.063 W, -55 to 155 degC, 0402 (1005 Metric); Voltage Rating: 50V; Power: 63mW; Pins: 2; Tolerance: 1%; Max Operating Temperature: 155°C; Case/Package: 0402; Min Operating Temperature: -55°C; Mounting Technology: SM; RoHS Compliant: True
R51 = CMP-009-00073-2: 1K6 0.063W 5% 0402 (1005 Metric)  SMD; Power: 63mW; Case/Package: 0402; Tolerance: 5%; Mounting Technology: SMT; Pins: 2
R53 = CMP-009-00064-2: 100K 0.063W 1% 0402 (1005 Metric)  SMD; Power: 63mW; Case/Package: 0402; Mounting Technology: SMT; Pins: 2; Tolerance: 1%
SSW1 = 53261-0371: CONN HEADER SMD R/A 3POS 1.25MM; Manufacturer: Molex; Manufacturer Series: 53261; Number of Contacts: 3; Connector Type: Blade Pin; Contact Resistance: 20mR; Option: General Purpose; Current Rating: 1A; Voltage Rating: 125V; Mixed Contacts: No; Number of Rows Loaded: 1; Insulation Resistance: 100MR; Supplier 1: Mouser; Supplier Part Number 1: 538-53261-0371; Manufacturer Part Number: 53261-0371; Stock 1: 43703; Pricing 1: 1=0.57, 10=0.426, 50=0.426, 100=0.373, 1000=0.274, 10000=0.221 (USD); Mount: Surface Mount,Board; Contact Plating: Tin; Contact Material: Bronze,Tin; Color: Natural; Housing Color: Natural; Housing Material: Nylon; Min Operating Temperature: -40°C; Max Operating Temperature: 85°C; Termination: Solder; Number of Rows: 1; Orientation: Right Angle; Packaging: Tape and Reel; Number of Positions: 3; Series: PicoBlade; Contact Type: Blade Pin; Contact Gender: Male; Mounting Style: STRAIGHT; Filter Feature: No; Voltage Rating (AC): 125V; Working Voltage: 125V; Length: 8.9mm; Pitch: 1.25mm; Depth: 5.2mm; Radiation Hardening: No; Flammability Rating: UL94 V-0; RoHS Compliant: Yes; MIL Conformance: No; DIN Conformance: No; IEC Conformance: No; REACH SVHC: Unknown; ComponentLink1URL: https://www.molex.com/pdm_docs/pk/SPK-53261-002-001.pdf?src-supplier=Digi-Key; ComponentLink1Description: https://www.molex.com/pdm_docs/pk/SPK-53261-002-001.pdf?src-supplier=Digi-Key; ComponentLink2URL: http://www.jameco.com/Jameco/Products/ProdDS/1302094.pdf?src-supplier=Jameco; ComponentLink2Description: http://www.jameco.com/Jameco/Products/ProdDS/1302094.pdf?src-supplier=Jameco; ComponentLink3URL: https://www.molex.com/pdm_docs/sd/532610371_sd.pdf?src-supplier=Digi-Key; ComponentLink3Description: https://www.molex.com/pdm_docs/sd/532610371_sd.pdf?src-supplier=Digi-Key; ComponentLink4URL: http://www.onlinecomponents.com/productFiles/mf-MOL/1620532610371_pcb_headers.pdf?src-supplier=Onlinecomponents.com; ComponentLink4Description: http://www.onlinecomponents.com/productFiles/mf-MOL/1620532610371_pcb_headers.pdf?src-supplier=Onlinecomponents.com; ComponentLink5URL: http://components.arrow.com/part/dataview/40924515S9851323N3303?src-supplier=Arrow+Electronics; ComponentLink5Description: http://components.arrow.com/part/dataview/40924515S9851323N3303?src-supplier=Arrow+Electronics; ComponentLink6URL: http://www.molex.com/webdocs/datasheets/pdf/en-us/0532610371_PCB_HEADERS.pdf?src-supplier=Avnet; ComponentLink6Description: http://www.molex.com/webdocs/datasheets/pdf/en-us/0532610371_PCB_HEADERS.pdf?src-supplier=Avnet; ComponentLink7URL: http://uk.rs-online.com/webdocs/1380/0900766b8138010c.pdf?src-supplier=RSComponents; ComponentLink7Description: http://uk.rs-online.com/webdocs/1380/0900766b8138010c.pdf?src-supplier=RSComponents
U1 U2 = IRF7329TRPBF: MOSFET 2P-CH 12V 9.2A 8-SOIC; Manufacturer: International Rectifier; Rise Time: 8.6ns; Fall Time: 260ns; Turn-On Delay Time: 10ns; Turn-Off Delay Time: 340ns; Gate to Source Voltage (Vgs): 8V; Rds On Max: 17mR; Input Capacitance: 3.45nF; Number of Elements: 2; Max Power Dissipation: 2W; Element Configuration: Dual; Drain to Source Breakdown Voltage: -12V; Current Rating: -9.2A; Supplier 1: Digi-Key; Supplier Part Number 1: IRF7329PBFCT-ND; Manufacturer Part Number: IRF7329TRPBF; Stock 1: 21693; Pricing 1: 1=1.23, 10=1.007, 25=0.988, 100=0.7831, 500=0.6638, 1000=0.5407 (USD); Mount: Surface Mount; Case/Package: SOIC; Number of Pins: 8; Min Operating Temperature: -55°C; Max Operating Temperature: 150°C; Continuous Drain Current (ID): 9.2A; Package Quantity: 1; Packaging: Tape and Reel; Drain to Source Voltage (Vdss): 12V; Drain to Source Resistance: 17mR; Power Dissipation: 2W; Voltage Rating (DC): -12V; Series: HEXFET®; Length: 5mm; Width: 4mm; Height: 1.5mm; Radiation Hardening: No; Lead Free: Lead Free; RoHS Compliant: Yes; ComponentLink1URL: https://www.infineon.com/dgdl/irf7329pbf.pdf?fileId=5546d462533600a4015355f617841b55&src-supplier=Digi-Key; ComponentLink1Description: https://www.infineon.com/dgdl/irf7329pbf.pdf?fileId=5546d462533600a4015355f617841b55&src-supplier=Digi-Key; ComponentLink2URL: https://www.verical.com/server-webapp/html/getDatasheet?partID=357970&src-supplier=Verical; ComponentLink2Description: https://www.verical.com/server-webapp/html/getDatasheet?partID=357970&src-supplier=Verical; ComponentLink3URL: http://datasheet.iiic.cc/international_rectifier/IRF7329TRPBF.pdf?src-supplier=IIIC; ComponentLink3Description: http://datasheet.iiic.cc/international_rectifier/IRF7329TRPBF.pdf?src-supplier=IIIC
U3 = TPS621361RGXR: IC REG BUCK ADJUSTABLE 4A 11VQFN; Manufacturer: Texas Instruments; Output Configuration: Positive; Number of Outputs: 1; Min Input Voltage: 3V; Max Input Voltage: 17V; Min Output Voltage: 800mV; Max Output Voltage: 12V; Switching Frequency: 1MHz; Synchronous Rectifier: Yes; Supplier 1: Digi-Key; Supplier Part Number 1: 296-50117-1-ND; Manufacturer Part Number: TPS621361RGXR; Stock 1: 4700; Pricing 1: 1=2.28, 10=2.051, 25=1.9344, 100=1.5476, 250=1.3542, 500=1.3155, 1000=1.0446 (USD); Mount: Surface Mount; Case/Package: VQFN; Number of Pins: 11; Min Operating Temperature: -40°C; Max Operating Temperature: 125°C; Output Type: Adjustable; Packaging: Cut Tape; Output Current: 4A; RoHS Compliant: Yes; ComponentLink1URL: http://www.ti.com/lit/ds/symlink/tps62136.pdf?src-supplier=Digi-Key; ComponentLink1Description: http://www.ti.com/lit/ds/symlink/tps62136.pdf?src-supplier=Digi-Key
U4 = LT6106HS5#TRPBF: IC OPAMP CURR SENSE TSOT23-5; Manufacturer: Linear Technology; Manufacturer Part Number: LT6106HS5#TRMPBF; Amplifier Type: Current Sense; Current - Supply: 70µA; Voltage - Supply, Single/Dual (±): 2.7 V ~ 36 V; Supplier 1: Digi-Key; RoHS: RoHS Compliant; Category: Integrated Circuits (ICs); Stock 1: 7462; Pricing 1: 1=2.3, 25=2.0504, 100=1.3586, 250=1.24544 (USD); Packaging: Cut Tape (CT); Part Status: Active; Output Type: -; Slew Rate: -; Operating Temperature: -40°C ~ 125°C; Mounting Type: Surface Mount; Package / Case: SOT-23-5 Thin, TSOT-23-5; Supplier Device Package: TSOT-23-5; Base Part Number: LT6106; ComponentLink1URL: http://www.linear.com/docs/24992; ComponentLink1Description: http://www.linear.com/docs/24992; Supplier Part Number 1: LT6106HS5#TRMPBFCT-ND
U5 = G6SK-2G DC5: RELAY TELECOM DPDT 2A 5V; Manufacturer: Omron Electronics Inc-EMC Div; Coil Type: Latching, Dual Coil; Coil Voltage: 5VDC; Contact Form: DPDT (2 Form C); Switching Voltage: 250VAC, 220VDC - Max; Turn On Voltage (Max): 3.75 VDC; Coil Power: 200 mW; Supplier 1: Digi-Key; Manufacturer Part Number: G6SK-2G DC5; RoHS: RoHS Compliant; Category: Relays; Stock 1: 0; Pricing 1: 1000=2.65888 (USD); Packaging: Tube; Part Status: Active; Relay Type: Telecom; Turn Off Voltage (Min): -; Features: -; Mounting Type: Surface Mount; Termination Style: J Lead; Operating Temperature: -40°C ~ 85°C; Contact Material: Silver (Ag), Gold (Au); ComponentLink1URL: http://omronfs.omron.com/en_US/ecb/products/pdf/en-g6s.pdf; ComponentLink1Description: http://omronfs.omron.com/en_US/ecb/products/pdf/en-g6s.pdf; Supplier Part Number 1: G6SK-2G-DC5-ND
U6 = TPS621361RGXR: No Description Available; Mfr_Name: Texas Instruments; Type: DEV; RefDes: RefDes; Copyright: Copyright (C) 2022 Ultra Librarian. All rights reserved.; Manufacturer_Part_Number: TPS621361RGXR
U7 U11 = CD74HC4051QPWRQ1: IC MUX/DEMUX 8X1 16TSSOP; Manufacturer: Texas Instruments; Multiplexer/Demultiplexer Circuit: 8:1; On-State Resistance (Max): 130 Ohm; Channel-to-Channel Matching (&Delta;Ron): 5 Ohm; Voltage - Supply, Single (V+): 2 V ~ 6 V; Voltage - Supply, Dual (V±): ±1 V ~ 5 V; -3db Bandwidth: 180MHz; Channel Capacitance (CS(off), CD(off)): 25pF; Current - Leakage (IS(off)) (Max): 400nA; Supplier 1: Digi-Key; Manufacturer Part Number: CD74HC4051QPWRQ1; RoHS: RoHS Compliant; Category: Integrated Circuits (ICs); Stock 1: 59; Pricing 1: 1=0.58, 10=0.51, 100=0.3909, 500=0.309, 1000=0.2472 (USD); Packaging: Digi-Reel®; Part Status: Active; Switch Circuit: -; Switch Time (Ton, Toff) (Max): -; Charge Injection: -; Crosstalk: -; Operating Temperature: -40°C ~ 125°C (TA); Package / Case: 16-TSSOP (0.173", 4.40mm Width); Supplier Device Package: 16-TSSOP; Base Part Number: 74HC4051; ComponentLink1URL: http://www.ti.com/lit/ds/symlink/cd74hc4051-q1.pdf; ComponentLink1Description: http://www.ti.com/lit/ds/symlink/cd74hc4051-q1.pdf; Supplier Part Number 1: 296-31590-6-ND
U8 = INA286AQDRQ1: IC CURRENT SHUNT MONITOR 8SOIC; Manufacturer: Texas Instruments; Number of Amplifiers: 1; Input Bias Current: 25uA; Bandwidth: 10kHz; Min Supply Voltage: 2.7V; Max Supply Voltage: 18V; Input Offset Voltage (Vos): 20uV; Common Mode Rejection Ratio: 140dB; Accuracy: 0.4%; Supplier 1: Digi-Key; Supplier Part Number 1: 296-42504-1-ND; Manufacturer Part Number: INA286AQDRQ1; Stock 1: 1000; Pricing 1: 1=3.91, 10=3.511, 25=3.3188, 100=2.7288, 250=2.4485, 500=2.36, 1000=1.9618 (USD); Mount: Surface Mount; Case/Package: SOIC; Number of Pins: 8; Min Operating Temperature: -40°C; Max Operating Temperature: 125°C; Packaging: Cut Tape; REACH SVHC: No SVHC; Lead Free: Lead Free; ComponentLink1URL: http://www.ti.com/general/docs/lit/getliterature.tsp?genericPartNumber=INA286-Q1&&fileType=pdf&src-supplier=Farnell; ComponentLink1Description: http://www.ti.com/general/docs/lit/getliterature.tsp?genericPartNumber=INA286-Q1&&fileType=pdf&src-supplier=Farnell; ComponentLink2URL: http://www.ti.com/lit/ds/symlink/ina283-q1.pdf?src-supplier=Digi-Key; ComponentLink2Description: http://www.ti.com/lit/ds/symlink/ina283-q1.pdf?src-supplier=Digi-Key; ComponentLink3URL: http://www.ti.com/general/docs/lit/getliterature.tsp?genericPartNumber=INA284-Q1&&fileType=pdf&src-supplier=Avnet; ComponentLink3Description: http://www.ti.com/general/docs/lit/getliterature.tsp?genericPartNumber=INA284-Q1&&fileType=pdf&src-supplier=Avnet; ComponentLink4URL: http://www.ti.com/general/docs/lit/getliterature.tsp?genericPartNumber=INA286-Q1&&fileType=pdf&src-supplier=Element14; ComponentLink4Description: http://www.ti.com/general/docs/lit/getliterature.tsp?genericPartNumber=INA286-Q1&&fileType=pdf&src-supplier=Element14
U9 = LTC3119EUFD#PBF: IC REG BCK BST ADJ 5A 28QFN; Manufacturer: Analog Devices / Linear Technology; Supplier 1: Digi-Key; Supplier Part Number 1: LTC3119EUFD#PBF-ND; Manufacturer Part Number: LTC3119EUFD#PBF; Stock 1: 0; Pricing 1: 1=14.26, 10=13.105, 25=12.5616, 100=10.5245, 250=9.8455, 500=9.1665, 1000=9.0307 (USD); RoHS Compliant: Yes; ComponentLink1URL: http://www.linear.com/docs/56069?src-supplier=Digi-Key; ComponentLink1Description: http://www.linear.com/docs/56069?src-supplier=Digi-Key
U10 = CMP-019-00012-3: Lithium Ion Battery Charger for Solar-Powered System, 4.4 to 6 V, 650 uA, -40 to 85 degC, 8-Pin DFN, RoHS; Manufacturer: Consonance Electronic; RoHS Compliant: Unknown; Package Reference: DFN-8; Datasheet URL: http://www.consonance-elec.com/pdf/datasheet/DSE-CN3065.pdf; Manufacturer URL: http://www.consonance-elec.com/; Datasheet Version: Rev. 1.0, 09/2009; Mounting Technology: SM; Case/Package: DFN-8; Package Description: 8-Pin Small Outline No-lead Package, Body 3 x 3 mm, Pitch 0.5 mm